# EAGLE schematic F303K8T6 (EAGLE 9.6.2)
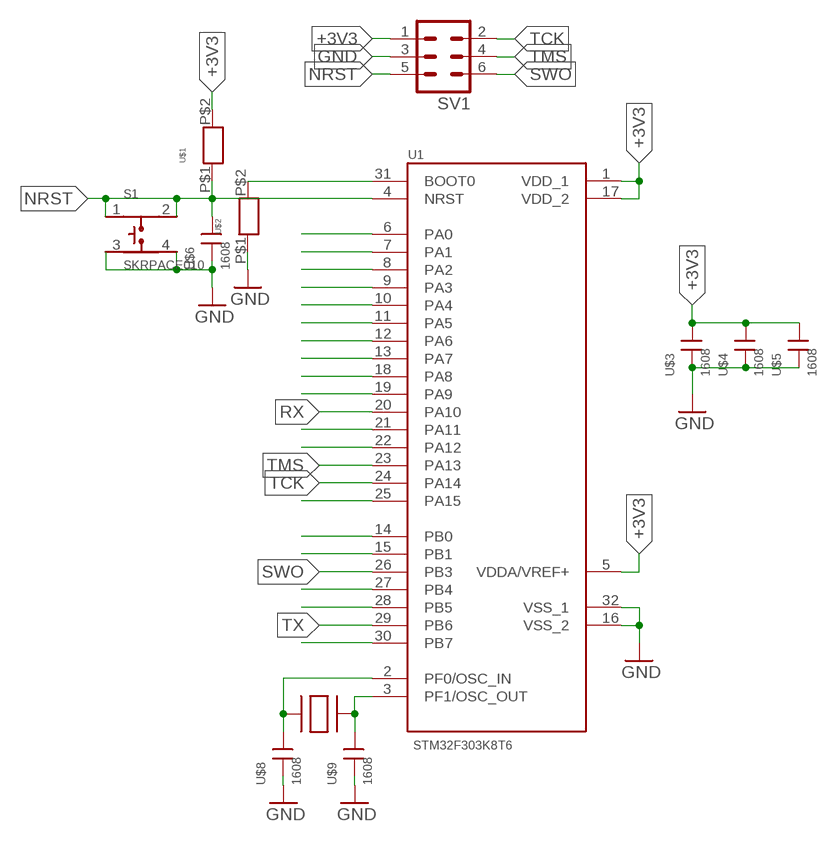
[diagram p0: schematic, sheet 1]

## Parts
S1  SKRPACE010  [SW_SKRPACE010]
SV1  ML6  [ML6]
U1  STM32F303K8T6  [QFP80P900X900X160-32N]
U$1  R  [1608]
U$2  R  [1608]
U$3  1608  [CON]
U$4  1608  [CON]
U$5  1608  [CON]
U$6  1608  [CON]
U$7  SUISYOU  [水晶]
U$8  1608  [CON]
U$9  1608  [CON]

## Nets
+3V3: SV1.1 U1.1(VDD_1) U1.5(VDDA/VREF+) U1.17(VDD_2) U$1.P$2 U$3.P$1 U$4.P$1 U$5.P$1
GND: S1.3 S1.4 SV1.3 U1.16(VSS_2) U1.32(VSS_1) U$2.P$1 U$3.P$2 U$4.P$2 U$5.P$2 U$6.P$2 U$8.P$2 U$9.P$2
N$5: U1.31(BOOT0) U$2.P$2
N$9: U1.2(PF0/OSC_IN) U$7.P$1 U$8.P$1
N$10: U1.3(PF1/OSC_OUT) U$7.P$2 U$9.P$1
N$11: U1.6(PA0)
N$12: U1.7(PA1)
N$13: U1.8(PA2)
N$14: U1.9(PA3)
N$15: U1.10(PA4)
N$16: U1.13(PA7)
N$17: U1.12(PA6)
N$18: U1.11(PA5)
N$19: U1.22(PA12)
N$20: U1.21(PA11)
N$21: U1.18(PA8)
N$22: U1.19(PA9)
N$25: U1.25(PA15)
N$26: U1.14(PB0)
N$28: U1.15(PB1)
N$29: U1.27(PB4)
N$30: U1.28(PB5)
N$31: U1.30(PB7)
NRST: S1.1 S1.2 SV1.5 U1.4(NRST) U$1.P$1 U$6.P$1
RX: U1.20(PA10)
SWO: SV1.6 U1.26(PB3)
TCK: SV1.2 U1.24(PA14)
TMS: SV1.4 U1.23(PA13)
TX: U1.29(PB6)

## Library data of the parts
S1 = SKRPACE010:SKRPACE010: Switch Tactile N.O. SPST Button J-Bend 0.05A 16VDC 2.55N SMD Automotive T/R Check prices <https://pricing.snapeda.com/parts/SKRPACE010/ALPS/view-part?ref=eda>; AVAILABILITY: In Stock; DESCRIPTION: Switch Tactile N.O. SPST Button J-Bend 0.05A 16VDC 2.55N SMD Automotive T/R; MF: ALPS; MP: SKRPACE010; PACKAGE: None; PRICE: None
SV1 = con-ml:ML6: HARTING; OC_FARNELL: unknown; OC_NEWARK: unknown
U1 = STM32F303K8T6:STM32F303K8T6: Analog and DSP with FPU ARM Cortex-M4 MCU with 64 Kbytes Flash, 72 MHz CPU, CCM, 12-bit ADC 5 MSPS, comparators, op-amp Check availability <https://pricing.snapeda.com/parts/STM32F303K8T6/STMicroelectronics/view-part?ref=eda>; AVAILABILITY: In Stock; DESCRIPTION: ARM® Cortex®-M4 STM32F3 Microcontroller IC 32-Bit 72MHz 64KB (64K x 8) FLASH 32-LQFP (7x7); MF: STMicroelectronics; MP: STM32F303K8T6; PACKAGE: LQFP-32 STMicroelectronics; PRICE: None; PURCHASE-URL: https://pricing.snapeda.com/search/part/STM32F303K8T6/?ref=eda
U$1 U$2 = R 1608:R
U$3-U$6 U$8 U$9 = con1608:1608
U$7 = 水晶:SUISYOU